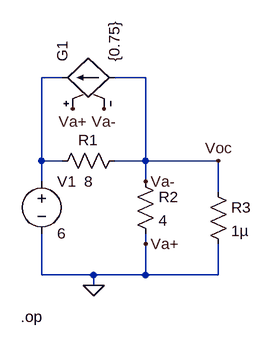
[diagram p0: schematic NodeVoltageAnalysisWithDependentSource.asc]
NodeVoltageAnalysisWithDependentSource.asc, the LTspice schematic file:
Version 4
SHEET 1 880 680
WIRE 176 -128 144 -128
WIRE 304 -128 256 -128
WIRE 144 0 144 -128
WIRE 176 0 144 0
WIRE 304 0 304 -128
WIRE 304 0 256 0
WIRE 416 0 304 0
WIRE 144 32 144 0
WIRE 304 32 304 0
WIRE 416 48 416 0
WIRE 304 128 304 112
WIRE 144 176 144 112
WIRE 224 176 144 176
WIRE 304 176 304 128
WIRE 304 176 224 176
WIRE 416 176 416 128
WIRE 416 176 304 176
WIRE 224 192 224 176
FLAG 224 192 0
FLAG 416 0 Voc
FLAG 304 128 Va+
FLAG 192 -80 Va+
FLAG 304 32 Va-
FLAG 240 -80 Va-
SYMBOL g 160 -128 R270
SYMATTR InstName G1
SYMATTR Value {0.75}
SYMBOL res 272 -16 R90
WINDOW 0 0 56 VBottom 2
WINDOW 3 32 56 VTop 2
SYMATTR InstName R1
SYMATTR Value 8
SYMBOL res 288 16 R0
SYMATTR InstName R2
SYMATTR Value 4
SYMBOL voltage 144 16 R0
WINDOW 123 0 0 Left 0
WINDOW 39 0 0 Left 0
SYMATTR InstName V1
SYMATTR Value 6
SYMBOL res 400 32 R0
SYMATTR InstName R3
SYMATTR Value 1µ
TEXT 112 240 Left 2 !.op

The netlist it stands for:
* NodeVoltageAnalysisWithDependentSource.asc
G1 Va- N001 0 Va- {0.75}
R1 Va- N001 8
R2 Va- 0 4
V1 N001 0 6
R3 Va- 0 1µ
.op
.backanno
.end